# EAGLE design untitled (EAGLE 5.11)
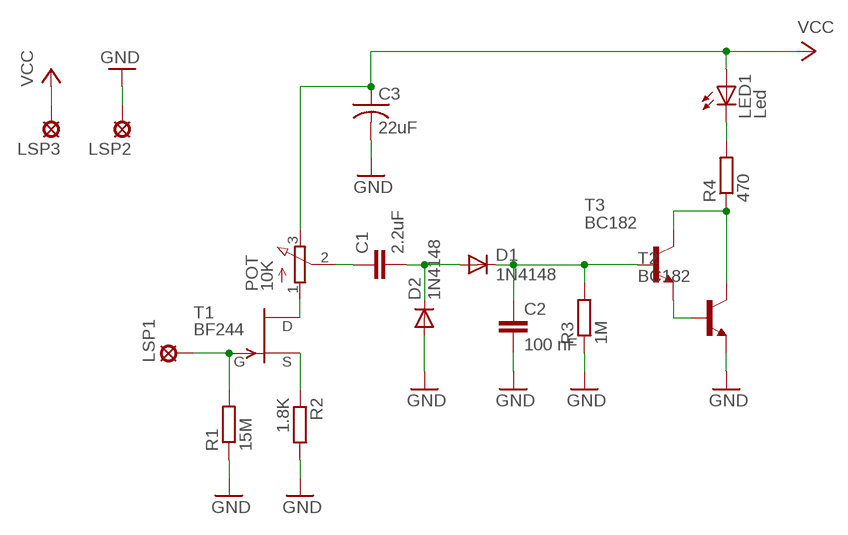
[diagram p0: schematic, sheet 1]

## Parts
C1  2.2uF  C-EU025-024X044  [C025-024X044]
C2  100 nF  C-EU025-024X044  [C025-024X044]
C3  22uF  C-US050-024X044  [C050-024X044]
D1  1N4148  1N4148DO35-7  [DO35-7]
D2  1N4148  1N4148DO35-7  [DO35-7]
LED1  Led  LED5MM  [LED5MM]
LSP1  LSP11  [LSP11]
LSP2  LSP11  [LSP11]
LSP3  LSP11  [LSP11]
POT  10K  3RP/1610N  [3RP/1610N]
R1  15M  R-EU_0204/7  [0204/7]
R2  1.8K  R-EU_0204/7  [0204/7]
R3  1M  R-EU_0204/7  [0204/7]
R4  470  R-EU_0204/7  [0204/7]
T1  BF244  BF256  [TO92]
T2  BC182  BC547B  [TO92]
T3  BC182  BC547B  [TO92]

## Nets
GND: C2.2 C3.2 D2.A LSP2.MP R1.1 R2.2 R3.1 T2.1(E)
N$1: LSP1.MP R1.2 T1.3(G)
N$2: R2.1 T1.2(S)
N$3: POT.1(A) T1.1(D)
N$5: C1.1 POT.2(S)
N$6: C1.2 D1.A D2.C
N$7: C2.1 D1.C R3.2 T3.2(B)
N$8: T2.2(B) T3.1(E)
N$9: R4.1 T2.3(C) T3.3(C)
N$10: LED1.K(C) R4.2
VCC: C3.1 LED1.A LSP3.MP POT.3(E)

## Library data of the parts
C1 C2 = rcl:C-EU: CAPACITOR, European symbol
C3 = rcl:C-US: CAPACITOR, American symbol
D1 D2 = diode:1N4148: DIODE high speed (Philips)
LED1 = led:LED: LED OSRAM: - CHIPLED LG R971, LG N971, LY N971, LG Q971, LY Q971, LO R971, LY R971 LH N974, LH R974 LS Q976, LO Q976, LY Q976 LO Q996 - Hyper CHIPLED LW Q18S LB Q993, LB Q99A, LB R99A - SideLED LS A670, LO A670, LY A670, LG A670, LP A670 LB A673, LV A673, LT A673, LW A673 LH A674 LY A675 LS A676, LA A676, LO A676, LY A676, LW A676 LS A679, LY A679, LG A679 - Hyper Micro SIDELED® LS Y876, LA Y876, LO Y876, LY Y876 LT Y87S - SmartLED LW L88C, LW L88S LB L89C, LB L89S, LG L890 LS L89K, LO L89K, LY L89K LS L896, LA L896, LO L896, LY L896 - TOPLED LS T670, LO T670, LY T670, LG T670, LP T670 LSG T670, LSP T670, LSY T670, LOP T670, LYG T670 LG T671, LOG T671, LSG T671 LB T673, LV T673, LT T673, LW T673 LH T674 LS T676, LA T676, LO T676, LY T676, LB T676, LH T676, LSB T676, LW T676 LB T67C, LV T67C, LT T67C, LS T67K, LO T67K, LY T67K, LW E67C LS E67B, LA E67B, LO E67B, LY E67B, LB E67C, LV E67C, LT E67C LW T67C LS T679, LY T679, LG T679 LS T770, LO T770, LY T770, LG T770, LP T770 LB T773, LV T773, LT T773, LW T773 LH T774 LS E675, LA E675, LY E675, LS T675 LS T776, LA T776, LO T776, LY T776, LB T776 LHGB T686 LT T68C, LB T68C - Hyper Mini TOPLED® LB M676 - Mini TOPLED Santana® LG M470 LS M47K, LO M47K, LY M47K Source: http://www.osram.convergy.de LUXEON: - LUMILED® LXK2-PW12-R00, LXK2-PW12-S00, LXK2-PW14-U00, LXK2-PW14-V00 LXK2-PM12-R00, LXK2-PM12-S00, LXK2-PM14-U00 LXK2-PE12-Q00, LXK2-PE12-R00, LXK2-PE12-S00, LXK2-PE14-T00, LXK2-PE14-U00 LXK2-PB12-K00, LXK2-PB12-L00, LXK2-PB12-M00, LXK2-PB14-N00, LXK2-PB14-P00, LXK2-PB14-Q00 LXK2-PR12-L00, LXK2-PR12-M00, LXK2-PR14-Q00, LXK2-PR14-R00 LXK2-PD12-Q00, LXK2-PD12-R00, LXK2-PD12-S00 LXK2-PH12-R00, LXK2-PH12-S00 LXK2-PL12-P00, LXK2-PL12-Q00, LXK2-PL12-R00 Source: www.luxeon.com KINGBRIGHT: KA-3528ASYC Source: www.kingbright.com
LSP1-LSP3 = solpad:LSP11: SOLDER PAD drill 1.1 mm
POT = pot:3RP/1610N: 16mm Potentiometer one level Source: http://www.alphapotentiometers.net/html/16mm_pot_2.html
R1-R4 = rcl:R-EU_: RESISTOR, European symbol
T1 = transistor-fet:BF256: N-Channel Junction FET
T2 T3 = transistor-npn:BC547*: NPN Transistor

## Board
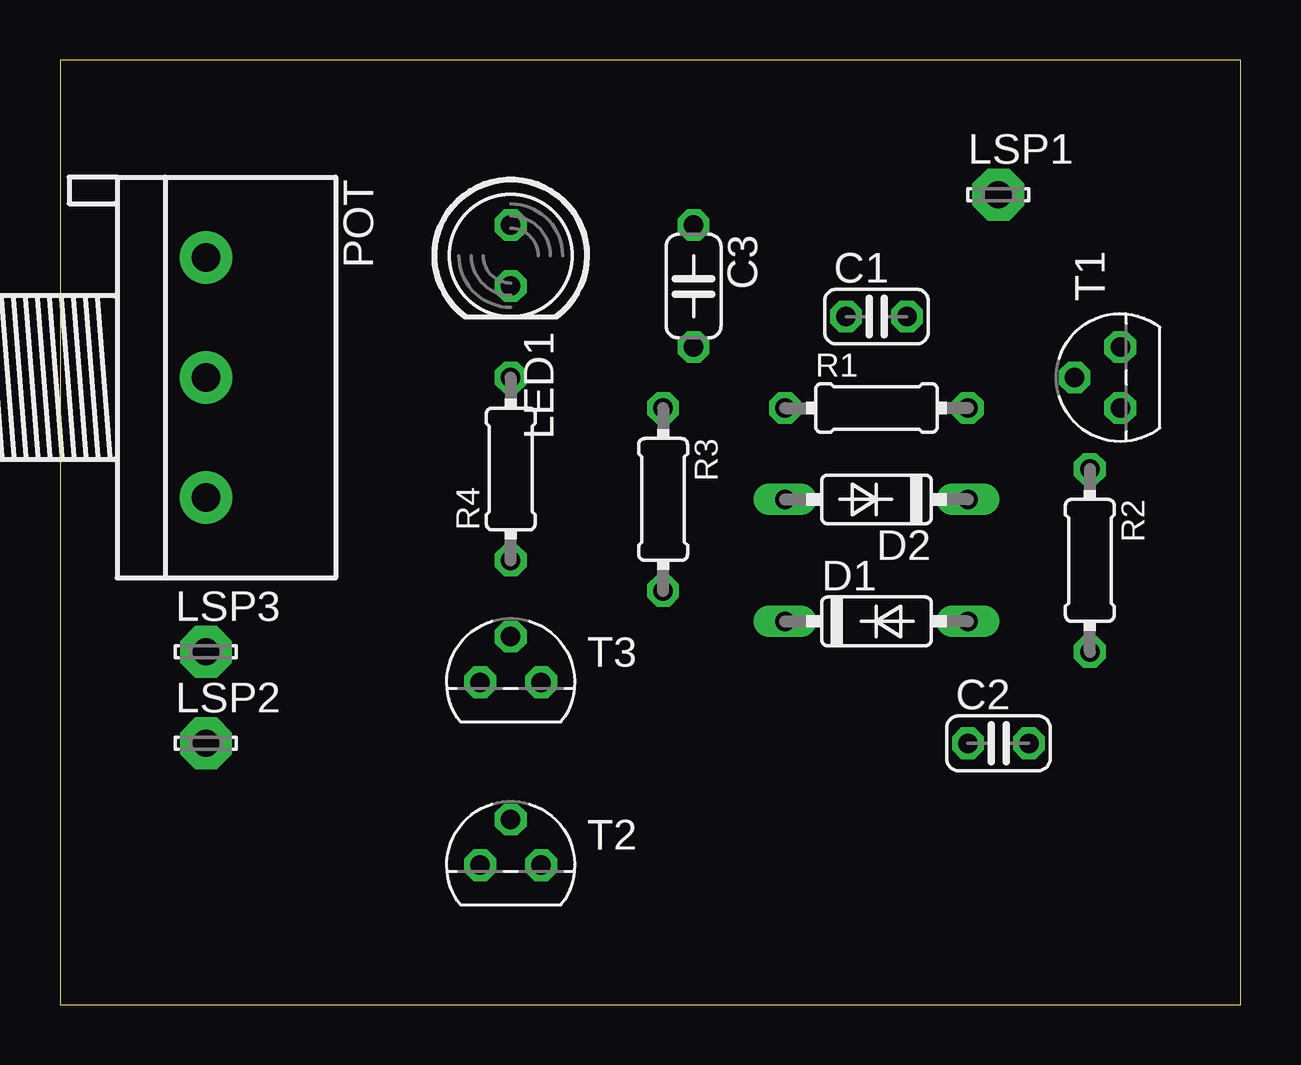
[diagram p1: board, top side]
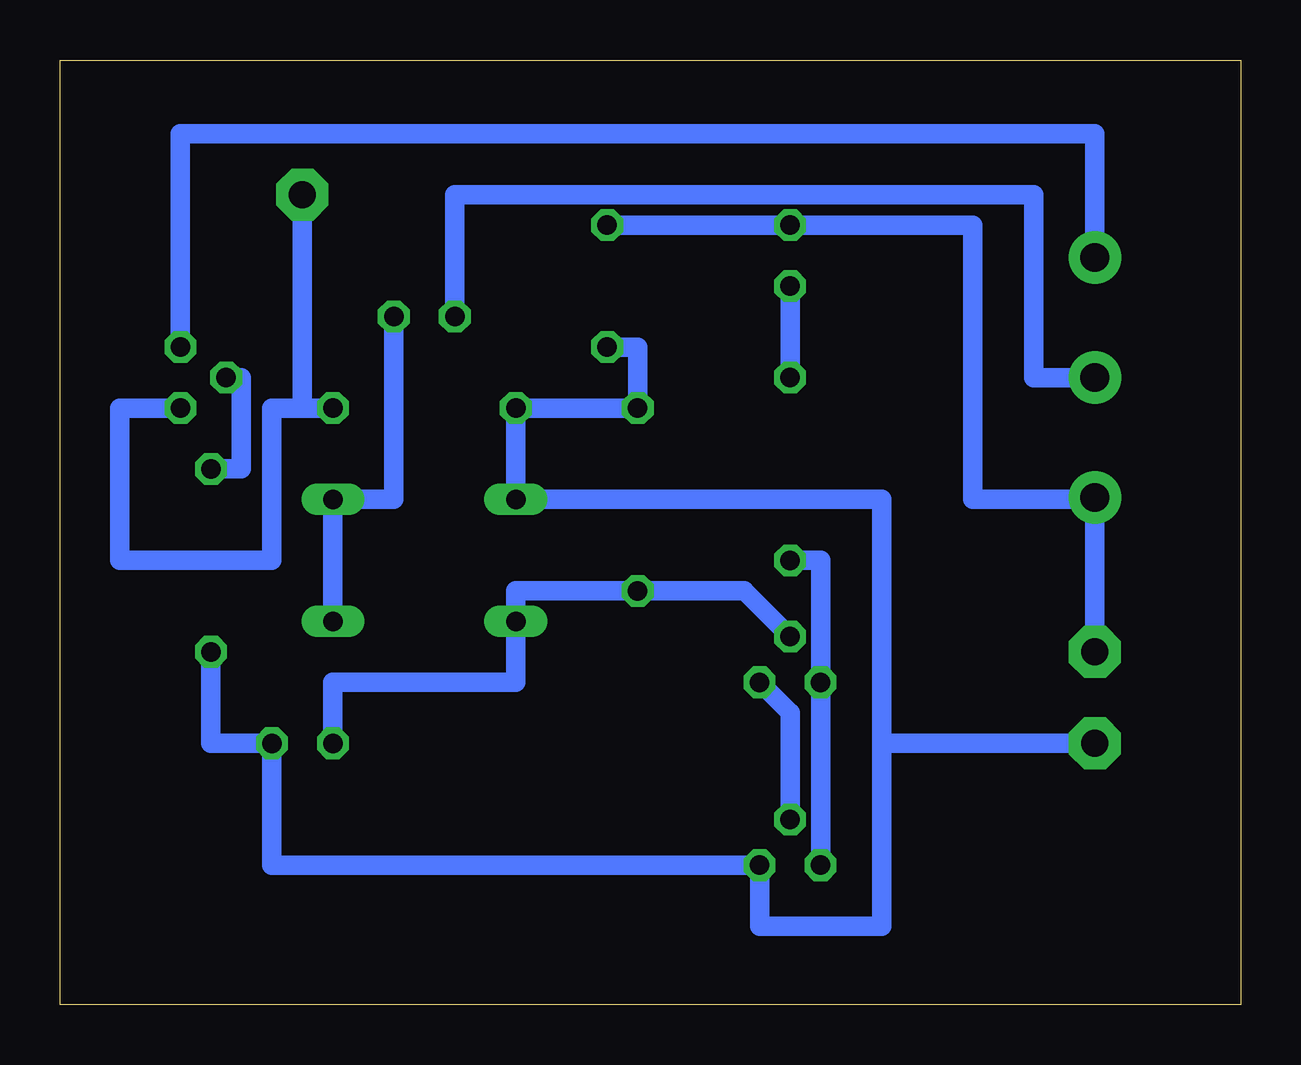
[diagram p2: board, bottom side, seen from below]

Size 49.2 x 39.36 mm. Coordinates in mm from the lower left corner, seen from the top.
Outline: 0,0 49.2,0 49.2,39.36 0,39.36 0,0
Copper layers (1*16): Top 0.035mm / dielectric 1.5mm / Bottom 0.035mm
Design rules "default": minimum track width 10mil, minimum drill 24mil, track to track 8mil, track to pad 8mil, pad to pad 8mil, via to via 8mil, smd to smd 8mil, copper to edge 40mil, drill to drill 8mil, minimum pad ring 10mil, minimum via ring 8mil, stop-mask expansion 4mil, vias tented up to drill 0mil, thermal gap 10mil

### Footprints (pad centres in the part's own frame; a part is rotated, then mirrored left to right if it is on the bottom)
C025-024X044 = drill 0.813 octagon: 1 -1.27,0; 2 1.27,0
C050-024X044 = drill 0.813 octagon: 1 -2.54,0; 2 2.54,0
DO35-7 = drill 0.813 long: A 3.81,0; C -3.81,0
LED5MM = drill 0.813 octagon: A -1.27,0; K 1.27,0
LSP11 = drill 1.118 pad 2.159 octagon: MP 0,0
3RP/1610N = drill 1.2 pad 2.184 round: 1 -5,0; 2 0,0; 3 5,0
0204/7 = drill 0.813 octagon: 1 -3.81,0; 2 3.81,0
TO92 = drill 0.813 octagon: 1 1.27,0; 2 0,1.905; 3 -1.27,0

### Placement (x,y rotation side)
C1  34.02,28.67 0 top
C2  39.1,10.89 0 top
C3  26.4,29.94 270 top
D1  34.02,15.97 0 top
D2  34.02,21.05 180 top
LED1  18.78,31.21 270 top
LSP1  39.1,33.75 0 top
LSP2  6.08,10.89 0 top
LSP3  6.08,14.7 0 top
POT  6.08,26.13 270 top
R1  34.02,24.86 0 top
R2  42.91,18.51 270 top
R3  25.13,21.05 270 top
R4  18.78,22.32 90 top
T1  44.18,26.13 90 top
T2  18.78,5.81 0 top
T3  18.78,13.43 0 top

### Tracks (layer width: path | path; a pad name or v marks a point on that pad's centre or on a via)
GND
  Bottom 0.813: R2.2 42.91,10.89 C2.2 40.37,5.81 T2.1 20.05,3.27 14.97,3.27 14.97,10.89 | C3.2 25.13,27.4 R3.1 R1.1 D2.A 14.97,21.05 14.97,10.89 | LSP2.MP 14.97,10.89
N$1
  Bottom 0.813: 39.1,24.86 40.37,24.86 40.37,18.51 46.72,18.51 46.72,24.86 T1.3 | 39.1,24.86 R1.2 | 39.1,24.86 LSP1.MP
N$2
  Bottom 0.813: T1.2 41.64,26.13 41.64,22.32 R2.1
N$3
  Bottom 0.813: POT.1 6.08,36.29 44.18,36.29 T1.1
N$5
  Bottom 0.813: POT.2 8.62,26.13 8.62,33.75 32.75,33.75 C1.1
N$6
  Bottom 0.813: C1.2 35.29,21.05 D2.C D1.A
N$7
  Bottom 0.813: T3.2 20.68,17.24 R3.2 30.21,17.24 D1.C 30.21,13.43 37.83,13.43 C2.1
N$8
  Bottom 0.813: T2.2 18.78,12.16 T3.1
N$9
  Bottom 0.813: T2.3 T3.3 17.51,18.51 R4.1
N$10
  Bottom 0.813: R4.2 LED1.K
VCC
  Bottom 0.813: 6.08,21.05 11.16,21.05 11.16,32.48 LED1.A C3.1 | 6.08,21.05 POT.3 | LSP3.MP 6.08,21.05